# EAGLE schematic ACME_V4 (EAGLE 9.2.2)
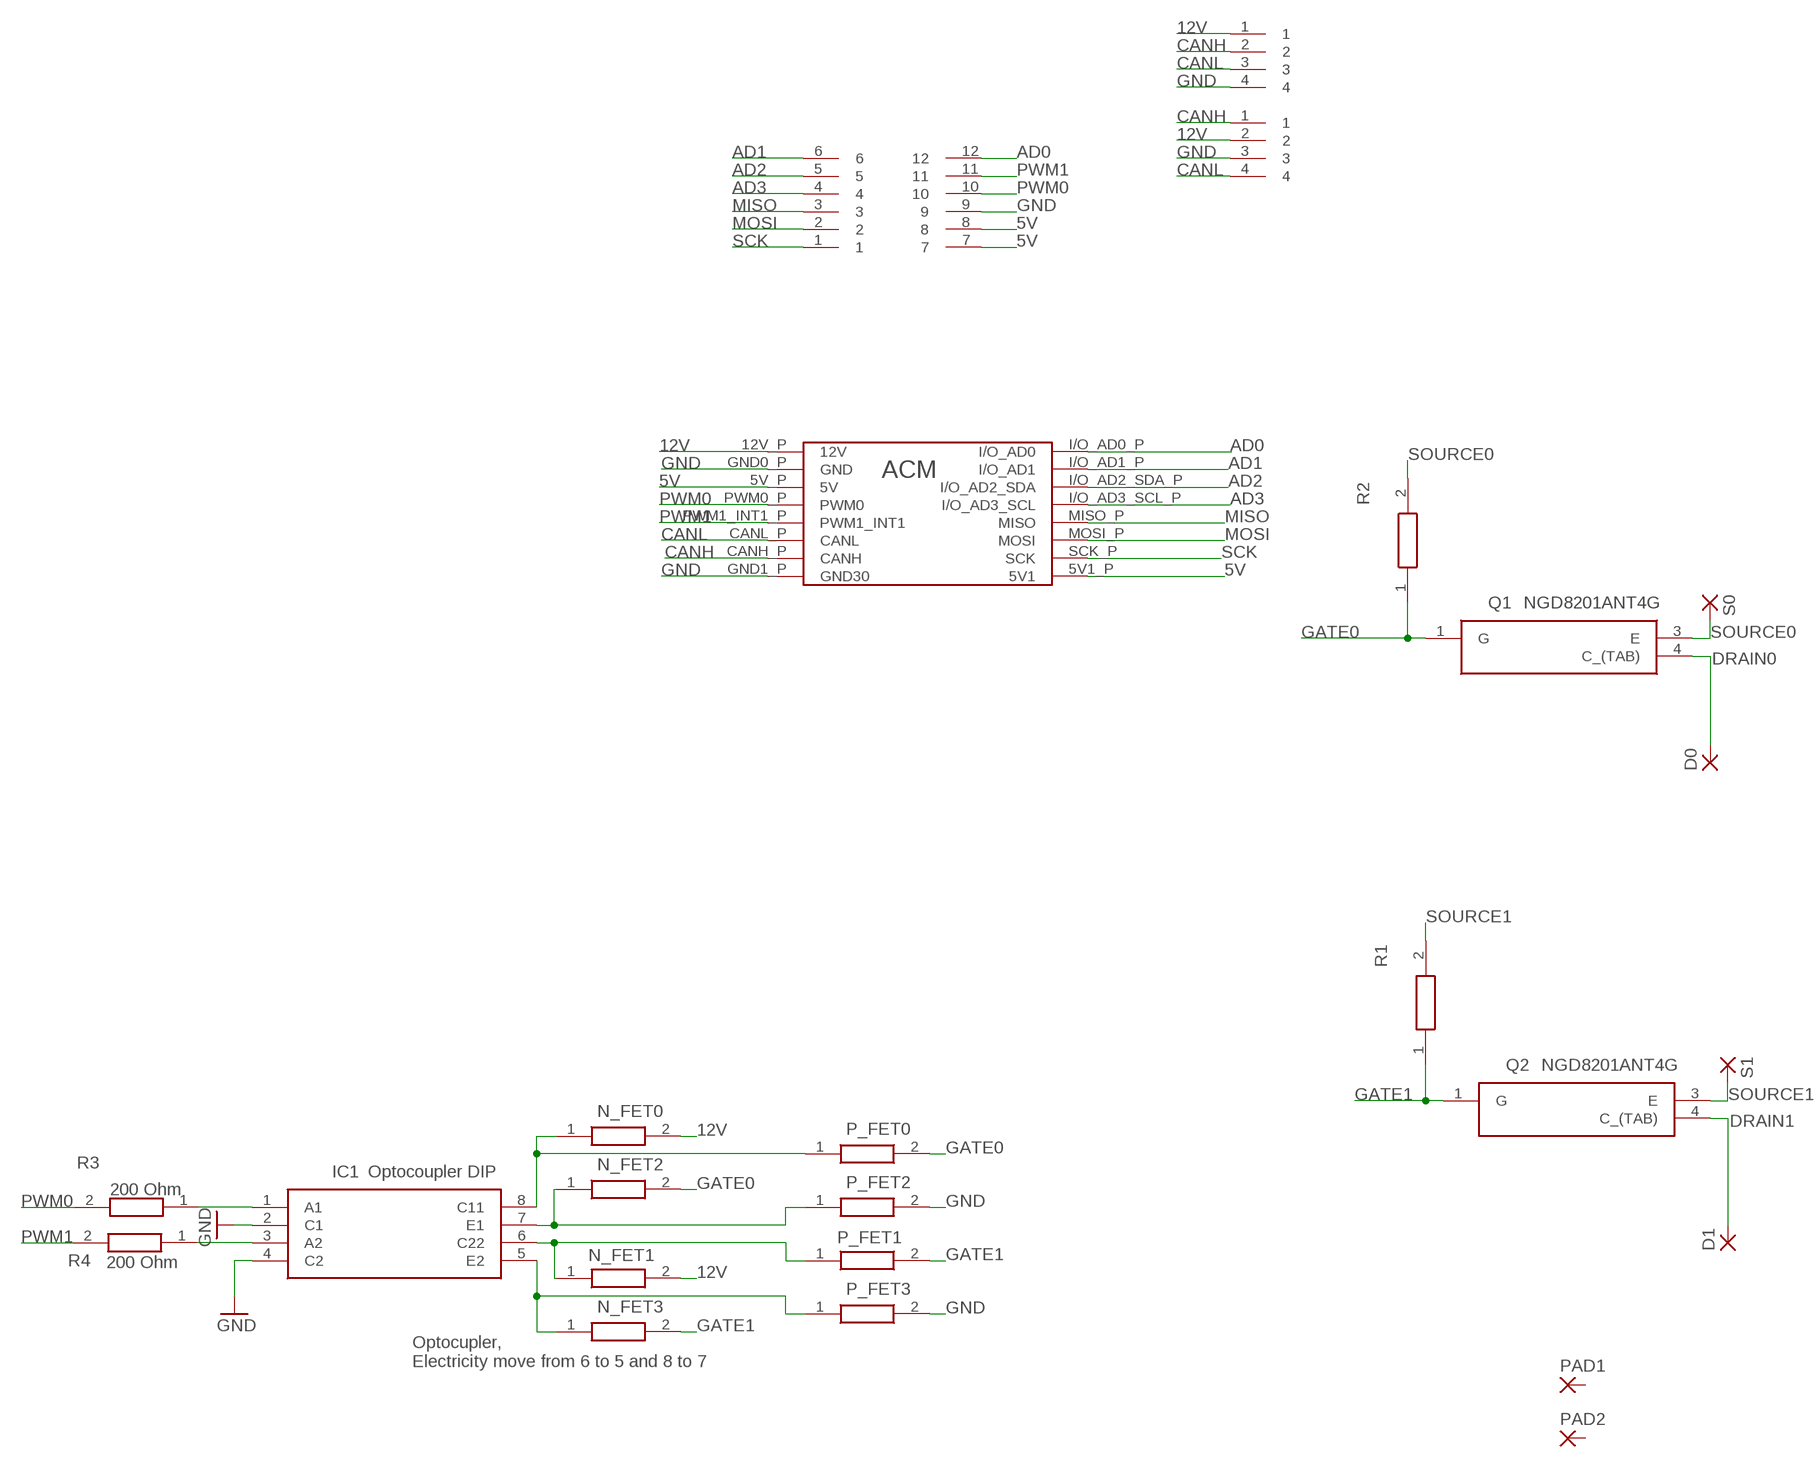
[diagram p0: schematic, sheet 1]

## Parts
D0  WIREPADSMD5-2,5  [5-2,5]
D1  WIREPADSMD5-2,5  [5-2,5]
IC1  Optocoupler DIP  TLP350(F)  [DIP762W60P254L966H485Q8N]
N_FET0  ERA-3AEB2262V  [RESC1608X55N]
N_FET1  ERA-3AEB2262V  [RESC1608X55N]
N_FET2  ERA-3AEB2262V  [RESC1608X55N]
N_FET3  ERA-3AEB2262V  [RESC1608X55N]
P_FET0  ERA-3AEB2262V  [RESC1608X55N]
P_FET1  ERA-3AEB2262V  [RESC1608X55N]
P_FET2  ERA-3AEB2262V  [RESC1608X55N]
P_FET3  ERA-3AEB2262V  [RESC1608X55N]
PAD1  2,54/1,1  [2,54/1,1]
PAD2  2,54/1,1  [2,54/1,1]
Q1  NGD8201ANT4G  [TO229P990X238-4N]
Q2  NGD8201ANT4G  [TO229P990X238-4N]
R1  ERA-3AEB2262V  [RESC1608X55N]
R2  ERA-3AEB2262V  [RESC1608X55N]
R3  200 Ohm  ERA-3AEB2262V  [RESC1608X55N]
R4  200 Ohm  ERA-3AEB2262V  [RESC1608X55N]
S0  WIREPADSMD5-2,5  [5-2,5]
S1  WIREPADSMD5-2,5  [5-2,5]
U$1  ACM_CASTELLATED  [ACM_CAS_FP]
U$2  16P_CONNECTOR  [16P_CONNECTOR_FP]
U$3  16P_CONNECTOR  [16P_CONNECTOR_FP]
U$4  16P_CONNECTOR  [16P_CONNECTOR_FP]

## Nets
5V: U$1.5V1_P(5V1) U$1.5V_P(5V) U$2.7 U$2.8
12V: N_FET0.2 N_FET1.2 U$1.12V_P(12V) U$3.1 U$4.2
AD0: U$1.I/O_AD0_P(I/O_AD0) U$2.12
AD1: U$1.I/O_AD1_P(I/O_AD1) U$2.6
AD2: U$1.I/O_AD2_SDA_P(I/O_AD2_SDA) U$2.5
AD3: U$1.I/O_AD3_SCL_P(I/O_AD3_SCL) U$2.4
CANH: U$1.CANH_P(CANH) U$3.2 U$4.1
CANL: U$1.CANL_P(CANL) U$3.3 U$4.4
DRAIN0: D0.1(P) Q1.4(C_(TAB))
DRAIN1: D1.1(P) Q2.4(C_(TAB))
GATE0: N_FET2.2 P_FET0.2 Q1.1(G) R2.1
GATE1: N_FET3.2 P_FET1.2 Q2.1(G) R1.1
GND: IC1.2(C1) IC1.4(C2) P_FET2.2 P_FET3.2 U$1.GND0_P(GND) U$1.GND1_P(GND30) U$2.9 U$3.4 U$4.3
MISO: U$1.MISO_P(MISO) U$2.3
MOSI: U$1.MOSI_P(MOSI) U$2.2
N$2: IC1.1(A1) R3.1
N$4: IC1.8(C11) N_FET0.1 P_FET0.1
N$5: IC1.6(C22) N_FET1.1 P_FET1.1
N$6: IC1.3(A2) R4.1
N$8: IC1.5(E2) N_FET3.1 P_FET3.1
N$9: IC1.7(E1) N_FET2.1 P_FET2.1
PWM0: R3.2 U$1.PWM0_P(PWM0) U$2.10
PWM1: R4.2 U$1.PWM1_INT1_P(PWM1_INT1) U$2.11
SCK: U$1.SCK_P(SCK) U$2.1
SOURCE0: Q1.3(E) R2.2 S0.1(P)
SOURCE1: Q2.3(E) R1.2 S1.1(P)
Unconnected: PAD1.1(P) PAD2.1(P)

## Notes on the sheet
- Optocupler,
  Electricity move from 6 to 5 and 8 to 7

## Library data of the parts
D0 D1 S0 S1 = wirepad:WIREPAD: Wire PAD connect wire on PCB
IC1 = TLP350(F):TLP350(F): Toshiba TLP350(F) DC Input Optocoupler, Through Hole, 8-Pin PDIP Source: Datasheet <https://toshiba.semicon-storage.com/info/docget.jsp?did=6217&prodName=TLP350>; DESCRIPTION: Toshiba TLP350(F) DC Input Optocoupler, Through Hole, 8-Pin PDIP; HEIGHT: 4.85mm; MANUFACTURER_NAME: Toshiba; MANUFACTURER_PART_NUMBER: TLP350(F); MOUSER_PART_NUMBER: 757-TLP350(F); MOUSER_PRICE-STOCK: https://www.mouser.com/Search/Refine.aspx?Keyword=757-TLP350%28F%29; RS_PART_NUMBER: 0186022P; RS_PRICE-STOCK: http://uk.rs-online.com/web/p/products/0186022P
N_FET0 N_FET1-N_FET3 P_FET0 P_FET1-P_FET3 R1-R4 = ERA-3AEB2262V(0603 Resistor):ERA-3AEB2262V: Thin Film Resistors - SMD 0603 22.6Kohm 0.1% 25ppm Source: Datasheet <https://industrial.panasonic.com/cdbs/www-data/pdf/RDA0000/AOA0000C237.pdf>; DESCRIPTION: Thin Film Resistors - SMD 0603 22.6Kohm 0.1% 25ppm; HEIGHT: 0.55mm; MANUFACTURER_NAME: Panasonic; MANUFACTURER_PART_NUMBER: ERA-3AEB2262V; MOUSER_PART_NUMBER: 667-ERA-3AEB2262V; MOUSER_PRICE-STOCK: https://www.mouser.com/Search/Refine.aspx?Keyword=667-ERA-3AEB2262V
PAD1 PAD2 = wirepad:2,54/1,1: THROUGH-HOLE PAD
Q1 Q2 = NGD8201ANT4G_Mosfet:NGD8201ANT4G: Source: Datasheet <http://www.onsemi.com/pub/Collateral/NGD8201N-D.PDF>; ALLIED_NUMBER: 70341208; ALLIED_PRICE-STOCK: http://www.alliedelec.com/on-semiconductor-ngd8201ant4g/70341208/; HEIGHT: 2.38mm; MANUFACTURER_NAME: ON Semiconductor; MANUFACTURER_PART_NUMBER: NGD8201ANT4G; MOUSER_PART_NUMBER: 7470901; MOUSER_PRICE-STOCK: http://uk.rs-online.com/web/p/products/7470901; RS_PART_NUMBER: 7470901; RS_PRICE-STOCK: http://uk.rs-online.com/web/p/products/7470901
U$1 = ACM_Pindown:ACM_CASTELLATED
U$2 = 12P_Connector holes:16P_CONNECTOR
U$3 U$4 = 4P_Connector holes:16P_CONNECTOR